# Altium project Oscilloscope.PrjPcb
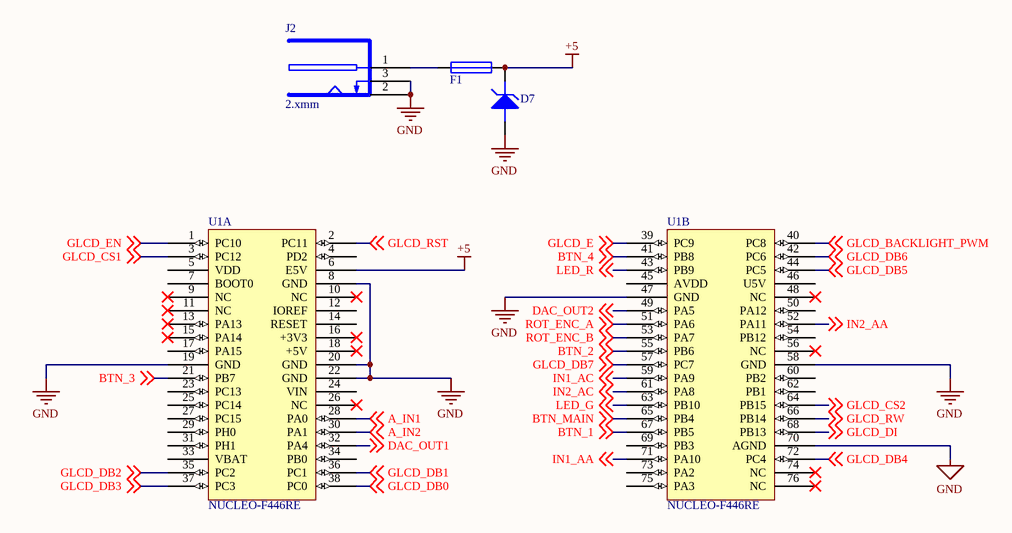
[diagram p0: Nucleo.SchDoc]
5 sheets, 102 parts. Net scope: global (net labels, ports and power ports of the same name join across sheets).
Board file: Oscilloscope.PcbDoc
Sheets:
  Nucleo.SchDoc
  InputStage.SchDoc
  GLCD.SchDoc
  IO.SchDoc
  OutputStage.SchDoc

## Sheet Nucleo.SchDoc: Nucleo
size A4; Organization: BME AUT; Address1: Magyar tudósok krt. 2.; Address2: Q épület; Address3: Budapest; Address4: H-1117; DocumentNumber: 1; Revision: 1.0; SheetNumber: 1; SheetTotal: 2

### Parts
D7  TRANS SUPPR  [FP_SMB]  (value not drawn)
F1  Multifuse  [FP_MULTIFUSE]  (value not drawn)
J2  2.xmm  [FP_DC_TAP_ANYA]
U1  NUCLEO-F446RE  [FP_NUCLEO-64]  (parts A,B of 2)

### Nets
+5: D7.1(CATHODE) F1.2 U1.6(E5V)
GND: D7.2(ANODE) J2.2(SLEEVE) J2.3(BREAK) U1.8(GND) U1.19(GND) U1.20(GND) U1.22(GND) U1.47(GND) U1.58(GND) U1.70(AGND)
A_IN1: U1.28(PA0) ; off-sheet A_IN1
A_IN2: U1.30(PA1) ; off-sheet A_IN2
BTN_1: U1.67(PB5) ; off-sheet BTN_1
BTN_2: U1.55(PB6) ; off-sheet BTN_2
BTN_3: U1.21(PB7) ; off-sheet BTN_3
BTN_4: U1.41(PB8) ; off-sheet BTN_4
BTN_MAIN: U1.65(PB4) ; off-sheet BTN_MAIN
DAC_OUT1: U1.32(PA4) ; off-sheet DAC_OUT1
DAC_OUT2: U1.49(PA5) ; off-sheet DAC_OUT2
GLCD_BACKLIGHT_PWM: U1.40(PC8) ; off-sheet GLCD_BACKLIGHT_PWM
GLCD_CS1: U1.3(PC12) ; off-sheet GLCD_CS1
GLCD_CS2: U1.64(PB15) ; off-sheet GLCD_CS2
GLCD_DB0: U1.38(PC0) ; off-sheet GLCD_DB0
GLCD_DB1: U1.36(PC1) ; off-sheet GLCD_DB1
GLCD_DB2: U1.35(PC2) ; off-sheet GLCD_DB2
GLCD_DB3: U1.37(PC3) ; off-sheet GLCD_DB3
GLCD_DB4: U1.72(PC4) ; off-sheet GLCD_DB4
GLCD_DB5: U1.44(PC5) ; off-sheet GLCD_DB5
GLCD_DB6: U1.42(PC6) ; off-sheet GLCD_DB6
GLCD_DB7: U1.57(PC7) ; off-sheet GLCD_DB7
GLCD_DI: U1.68(PB13) ; off-sheet GLCD_DI
GLCD_E: U1.39(PC9) ; off-sheet GLCD_E
GLCD_EN: U1.1(PC10) ; off-sheet GLCD_EN
GLCD_RST: U1.2(PC11) ; off-sheet GLCD_RST
GLCD_RW: U1.66(PB14) ; off-sheet GLCD_RW
IN1_AA: U1.71(PA10) ; off-sheet IN1_AA
IN1_AC: U1.59(PA9) ; off-sheet IN1_AC
IN2_AA: U1.52(PA11) ; off-sheet IN2_AA
IN2_AC: U1.61(PA8) ; off-sheet IN2_AC
LED_G: U1.63(PB10) ; off-sheet LED_G
LED_R: U1.43(PB9) ; off-sheet LED_R
ROT_ENC_A: U1.51(PA6) ; off-sheet ROT_ENC_A
ROT_ENC_B: U1.53(PA7) ; off-sheet ROT_ENC_B
NetF1_1: F1.1 J2.1(PIN)

Not connected (* = marked no-connect by the designer): U1 4(PD2) 5(VDD) 7(BOOT0) 9(NC)* 10(NC)* 11(NC)* 12(IOREF) 13(PA13)* 14(RESET) 15(PA14)* 16(+3V3)* 17(PA15) 18(+5V)* 23(PC13) 24(VIN) 25(PC14) 26(NC)* 27(PC15) 29(PH0) 31(PH1) 33(VBAT) 34(PB0) 45(AVDD) 46(U5V) 48(NC)* 50(PA12) 54(PB12) 56(NC)* 60(PB2) 62(PB1) 69(PB3) 73(PA2) 74(NC)* 75(PA3) 76(NC)*

### Notes on the sheet
- Title
- Size:
- Date:
- A4
- Number:
- Time:
- Revision:
- Sheet
- of
- File:

### Library data of the parts
D7 = TRANS SUPPR: Transient suppressor; Name: 6.7V Ubr 600W UNIDIR. 5V Urwm SMBJ5.0A (STM) DO-214AA (SMB) ˝BUZ˝; Voltage: 6.7V; Supplier: Lomex; Reference: 96-03-67
F1 = Multifuse: 1812 Multifuse; Name: 1.25A 15V 1812L125/16DR POLYFUSE SMD 1812 (LFS) ˝LF125-16˝; Reference: 44-04-71; Supplier: Lomex
J2 = DC_TAP_ANYA: 2.xmm DC HEBA25 TÁPFESZÜLTSÉG ALJZAT ZÁRT, NYÁKBA 90°; Name: TÁP DC ANYA 5.5/2.1/9.5mm DCS-5521-5; Supplier: Lomex; Reference: 43-07-67
U1 = NUCLEO-F446RE: Reference: NUCLEO; Name: Nucleo F446RE; Supplier: Tanszék

## Sheet InputStage.SchDoc: Input Stage
size A3; Organization: BME AUT; Address1: Magyar tudósok krt. 2.; Address2: Q épület; Address3: Budapest; Address4: H-1117; DocumentNumber: 1; Revision: 1.0; SheetNumber: 1; SheetTotal: 2
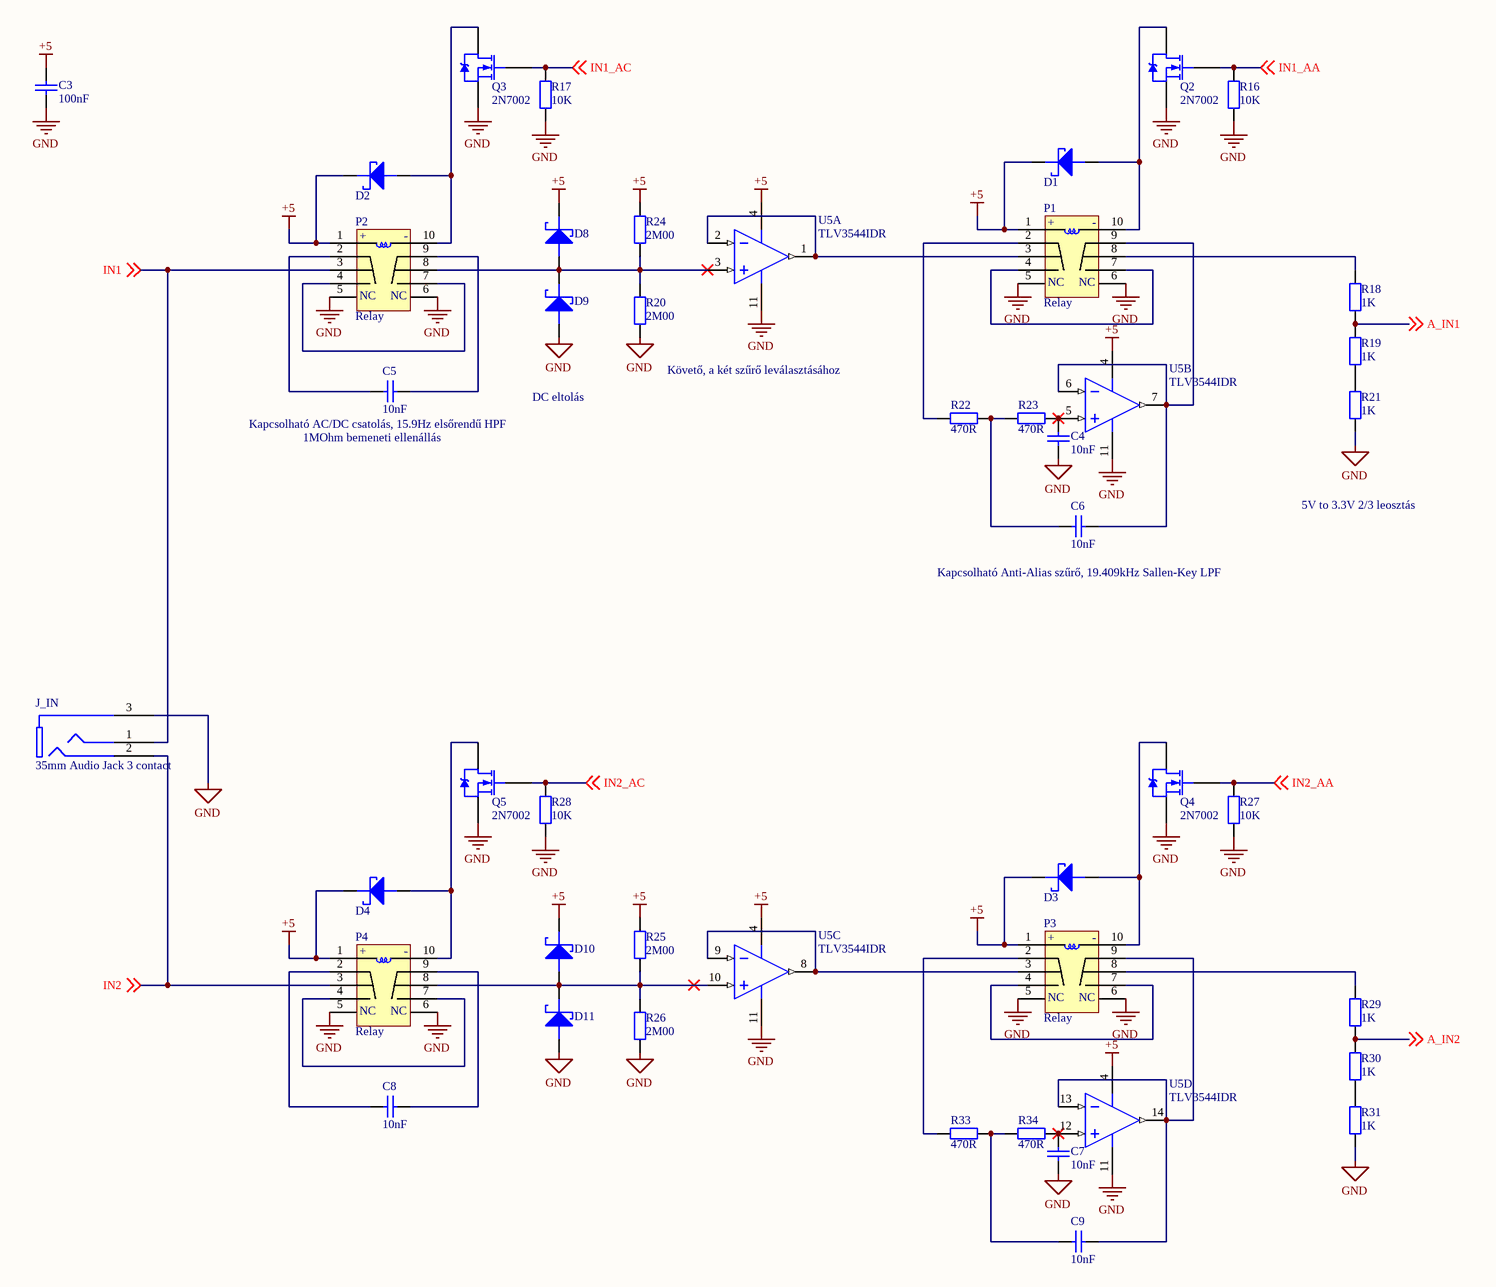
[diagram p1: InputStage.SchDoc]

### Parts
C3  100nF  [FP_0805_CAP_085]
C4  10nF  [FP_0805_CAP_085]
C5  10nF  [FP_0805_CAP_085]
C6  10nF  [FP_0805_CAP_085]
C7  10nF  [FP_0805_CAP_085]
C8  10nF  [FP_0805_CAP_085]
C9  10nF  [FP_0805_CAP_085]
D1  SCHOTTKY SMA  [FP_SMA]  (value not drawn)
D2  SCHOTTKY SMA  [FP_SMA]  (value not drawn)
D3  SCHOTTKY SMA  [FP_SMA]  (value not drawn)
D4  SCHOTTKY SMA  [FP_SMA]  (value not drawn)
D8  SCHOTTKY SMA  [FP_SMA]  (value not drawn)
D9  SCHOTTKY SMA  [FP_SMA]  (value not drawn)
D10  SCHOTTKY SMA  [FP_SMA]  (value not drawn)
D11  SCHOTTKY SMA  [FP_SMA]  (value not drawn)
J_IN  35mm Audio Jack 3 contact  [FP_35MM_JACK_SMALL_3PIN]
P1  Relay  [FP_RELAY]
P2  Relay  [FP_RELAY]
P3  Relay  [FP_RELAY]
P4  Relay  [FP_RELAY]
Q2  2N7002  [FP_SOT23-3]
Q3  2N7002  [FP_SOT23-3]
Q4  2N7002  [FP_SOT23-3]
Q5  2N7002  [FP_SOT23-3]
R16  10K  [FP_0805_RES]
R17  10K  [FP_0805_RES]
R18  1K  [FP_0805_RES]
R19  1K  [FP_0805_RES]
R20  2M00  [FP_0805_RES]
R21  1K  [FP_0805_RES]
R22  470R  [FP_0805_RES]
R23  470R  [FP_0805_RES]
R24  2M00  [FP_0805_RES]
R25  2M00  [FP_0805_RES]
R26  2M00  [FP_0805_RES]
R27  10K  [FP_0805_RES]
R28  10K  [FP_0805_RES]
R29  1K  [FP_0805_RES]
R30  1K  [FP_0805_RES]
R31  1K  [FP_0805_RES]
R33  470R  [FP_0805_RES]
R34  470R  [FP_0805_RES]
U5  TLV3544IDR  [FP_SOIC127P600X175-14M]  (parts A,B,C,D of 4)

### Nets
+5: C3.2 D1.1(CATHODE) D2.1(CATHODE) D3.1(CATHODE) D4.1(CATHODE) D8.1(CATHODE) D10.1(CATHODE) P1.1(+) P2.1(+) P3.1(+) P4.1(+) R24.2 R25.2 U5.4(V+)
GND: C3.1 C4.1 C7.1 D9.2(ANODE) D11.2(ANODE) J_IN.3(GND) P1.5 P1.6 P2.5 P2.6 P3.5 P3.6 P4.5 P4.6 Q2.3(S) Q3.3(S) Q4.3(S) Q5.3(S) R16.2 R17.1 R20.1 R21.1 R26.1 R27.2 R28.2 R31.1 U5.11(GND)
A_IN1: R18.1 R19.2 ; off-sheet A_IN1
A_IN2: R29.1 R30.2 ; off-sheet A_IN2
IN1: J_IN.1(SLEEVE1) P2.3 ; off-sheet IN1
IN1_AA: Q2.1(G) R16.1 ; off-sheet IN1_AA
IN1_AC: Q3.1(G) R17.2 ; off-sheet IN1_AC
IN2: J_IN.2(TIP) P4.3 ; off-sheet IN2
IN2_AA: Q4.1(G) R27.1 ; off-sheet IN2_AA
IN2_AC: Q5.1(G) R28.1 ; off-sheet IN2_AC
NetC4_2: C4.2 R23.2 U5.5(IN2+)
NetC5_1: C5.1 P2.2
NetC5_2: C5.2 P2.9
NetC6_1: C6.1 R22.2 R23.1
NetC6_2: C6.2 P1.9 U5.6(IN2-) U5.7(OUT2)
NetC7_2: C7.2 R34.2 U5.12(IN4+)
NetC8_1: C8.1 P4.2
NetC8_2: C8.2 P4.9
NetC9_1: C9.1 R33.2 R34.1
NetC9_2: C9.2 P3.9 U5.13(IN4-) U5.14(OUT4)
NetD1_2: D1.2(ANODE) P1.10(-) Q2.2(D)
NetD2_2: D2.2(ANODE) P2.10(-) Q3.2(D)
NetD3_2: D3.2(ANODE) P3.10(-) Q4.2(D)
NetD4_2: D4.2(ANODE) P4.10(-) Q5.2(D)
NetD8_2: D8.2(ANODE) D9.1(CATHODE) P2.8 R20.2 R24.1 U5.3(IN1+)
NetD10_2: D10.2(ANODE) D11.1(CATHODE) P4.8 R25.1 R26.2 U5.10(IN3+)
NetP1_2: P1.2 R22.1
NetP1_3: P1.3 U5.1(OUT1) U5.2(IN1-)
NetP1_4: P1.4 P1.7
NetP1_8: P1.8 R18.2
NetP2_4: P2.4 P2.7
NetP3_2: P3.2 R33.1
NetP3_3: P3.3 U5.8(OUT3) U5.9(IN3-)
NetP3_4: P3.4 P3.7
NetP3_8: P3.8 R29.2
NetP4_4: P4.4 P4.7
NetR19_1: R19.1 R21.2
NetR30_1: R30.1 R31.2

### Notes on the sheet
- DC eltolás
- (near R20) Követő, a két szűrő leválasztásához
- (near C5) Kapcsolható AC/DC csatolás, 15.9Hz elsőrendű HPF
- (near C5) 1MOhm bemeneti ellenállás
- 5V to 3.3V 2/3 leosztás
- (near C6) Kapcsolható Anti-Alias szűrő, 19.409kHz Sallen-Key LPF
- Title
- Size:
- Date:
- A3
- Number:
- Time:
- Revision:
- Sheet
- of
- File:
- (in symbol Relay Mini DPDT) NC

### Library data of the parts
C3 = CAP 100nF: Capacitor; Tolerance: 10%; Voltage: 50V; Name: 100nF 0805 10% 50V X7R 0805B104K500CT (WAL); Supplier: Lomex; Reference: 82-10-76; Value: 100nF
C4-C9 = CAP 10nF: Capacitor; Tolerance: 10%; Voltage: 100V; Name: 10nF 0805 10% 100V X7R 08051C103KAT2A (AVX); Supplier: Lomex; Reference: 82-11-02; Value: 10nF
D1-D4 D8-D11 = SCHOTTKY SMA: Schottky diode; pin to pad: 1>2 2>1; Name: 1A 40V DO-214AC SCH.RECT.LOW Vf SSL14 (TSC) SMA; Current: 1A; Voltage: 40V; Supplier: Lomex; Reference: 83-02-20
J_IN = 35mm Audio Jack 3 contact: 3.5mm Audio Jack MX-387GL; Name: MX-387GL -  Phone Audio Connector, 3 Contacts, Jack, 3.5 mm, PCB Mount, Metal Body; Reference: 1267376; Supplier: Farnell
P1-P4 = Relay Mini DPDT: Mini DPDT relay 14x9x5mm; Name: MECH 5V 2xMORSE 1A/30VDC 0.5A/12VAC A5W-K (TAK) 178R 14x9x5mm; Reference: 42-17-08; Supplier: Lomex
Q2-Q5 = 2N7002: N-channel MOSFET; pin to pad: 2>3 3>2; Name: MOSFET Transistor, N Channel, 300mA, 60V, 2.8 ohm, 10V, 2V; Voltage: 60V; Current: 300mA; Supplier: Lomex; Reference: 86-05-52
R16 R17 R27 R28 = RES 10K: Resistor; Tolerance: 5%; Power: 125mW; Name: 10K0 0805 5% CR-05JL7---10K 0.125W (VIK); Supplier: Lomex; Reference: 81-30-45; Value: 10K
R18 R19 R21 R29-R31 = RES 1K: Resistor; Tolerance: 5%; Power: 125mW; Name: 1K00 0805 5% WR08X102JTL 0.125W (WAL); Supplier: Lomex; Reference: 81-27-93; Value: 1K
R20 R24-R26 = RES 2M: Resistor; Tolerance: 1%; Power: 125mW; Name: 2M00 0805 1% CR-05FL7---2M0 0.125W (VIK); Supplier: Lomex; Reference: 80-17-98; Value: 2M00
R22 R23 R33 R34 = RES 470R: Resistor; Tolerance: 5%; Power: 125mW; Name: 470R 0805 5% CR-05JL7--470R 0.125W (VIK); Supplier: Lomex; Reference: 81-10-83; Value: 470R
U5 = TLV3544IDR: Operational Amplifier, RRIO, 4 Amplifier, 200 MHz, 150 V/µs, 2.5V to 5.5V, ± 1.25V to ± 2.75V, SOIC; Reference: 2851094; Name: TLV3544IDR . -  Operational Amplifier; Supplier: Farnell

## Sheet GLCD.SchDoc: GLCD
size A4; Organization: BME AUT; Address1: Magyar tudósok krt. 2.; Address2: Q épület; Address3: Budapest; Address4: H-1117; DocumentNumber: 1; Revision: 1.0; SheetNumber: 1; SheetTotal: 2
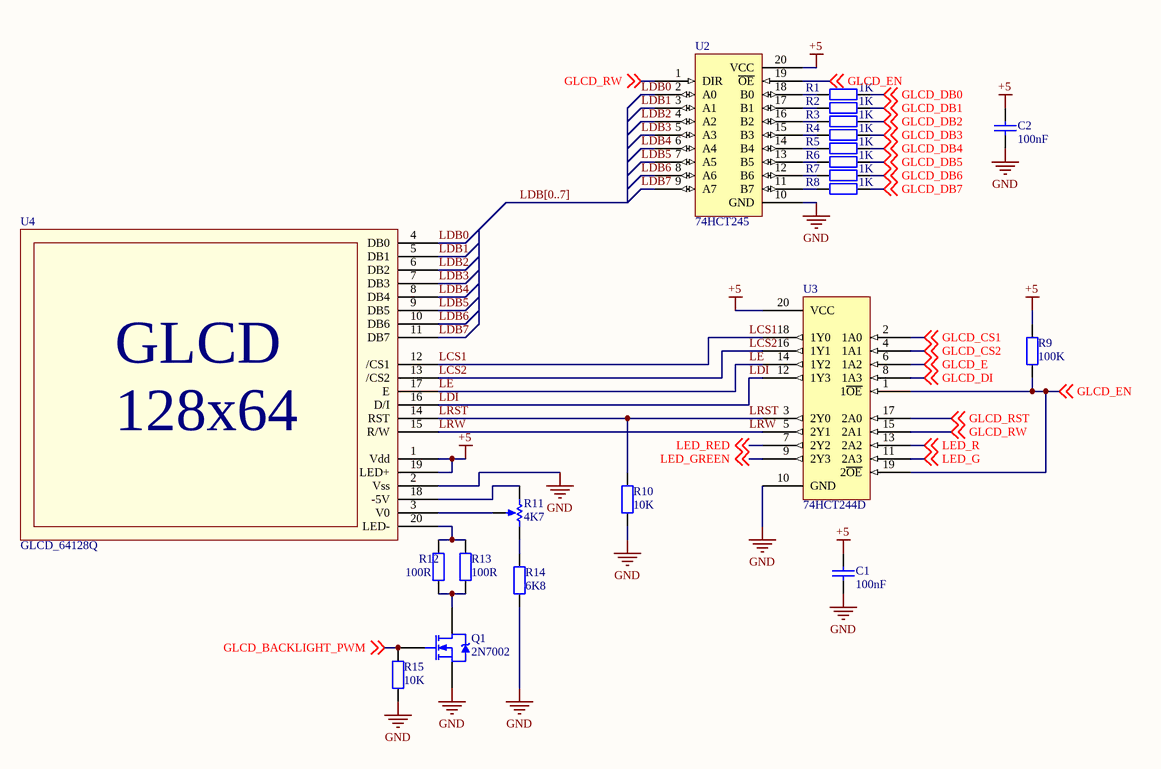
[diagram p2: GLCD.SchDoc]

### Parts
C1  100nF  [FP_0805_CAP_085]
C2  100nF  [FP_0805_CAP_085]
Q1  2N7002  [FP_SOT23-3]
R1  1K  [FP_0805_RES]
R2  1K  [FP_0805_RES]
R3  1K  [FP_0805_RES]
R4  1K  [FP_0805_RES]
R5  1K  [FP_0805_RES]
R6  1K  [FP_0805_RES]
R7  1K  [FP_0805_RES]
R8  1K  [FP_0805_RES]
R9  100K  [FP_0805_RES]
R10  10K  [FP_0805_RES]
R11  4K7  [FP_CERMET_SMD]
R12  100R  [FP_0805_RES]
R13  100R  [FP_0805_RES]
R14  6K8  [FP_0805_RES]
R15  10K  [FP_0805_RES]
U2  74HCT245  [FP_SOP127P1030X265-20M]
U3  74HCT244D  [FP_SOP127P1030X265-20M]
U4  GLCD_64128Q  [FP_GLCD_64128Q]

### Nets
+5: C1.2 C2.2 R9.2 U2.20(VCC) U3.20(VCC) U4.1(Vdd) U4.19(LED+)
GND: C1.1 C2.1 Q1.3(S) R10.1 R14.1 R15.1 U2.10(GND) U3.10(GND) U4.2(Vss)
GLCD_BACKLIGHT_PWM: Q1.1(G) R15.2 ; off-sheet GLCD_BACKLIGHT_PWM
GLCD_CS1: U3.2(1A0) ; off-sheet GLCD_CS1
GLCD_CS2: U3.4(1A1) ; off-sheet GLCD_CS2
GLCD_DB0: R1.2 ; off-sheet GLCD_DB0
GLCD_DB1: R2.2 ; off-sheet GLCD_DB1
GLCD_DB2: R3.2 ; off-sheet GLCD_DB2
GLCD_DB3: R4.2 ; off-sheet GLCD_DB3
GLCD_DB4: R5.2 ; off-sheet GLCD_DB4
GLCD_DB5: R6.2 ; off-sheet GLCD_DB5
GLCD_DB6: R7.2 ; off-sheet GLCD_DB6
GLCD_DB7: R8.2 ; off-sheet GLCD_DB7
GLCD_DI: U3.8(1A3) ; off-sheet GLCD_DI
GLCD_E: U3.6(1A2) ; off-sheet GLCD_E
GLCD_EN: R9.1 U2.19(~{OE}) U3.1(1~{OE}) U3.19(2~{OE}) ; off-sheet GLCD_EN
GLCD_RST: U3.17(2A0) ; off-sheet GLCD_RST
GLCD_RW: U2.1(DIR) U3.15(2A1) ; off-sheet GLCD_RW
LCS1: U3.18(1Y0) U4.12(/CS1)
LCS2: U3.16(1Y1) U4.13(/CS2)
LDB0: U2.2(A0) U4.4(DB0)
LDB1: U2.3(A1) U4.5(DB1)
LDB2: U2.4(A2) U4.6(DB2)
LDB3: U2.5(A3) U4.7(DB3)
LDB4: U2.6(A4) U4.8(DB4)
LDB5: U2.7(A5) U4.9(DB5)
LDB6: U2.8(A6) U4.10(DB6)
LDB7: U2.9(A7) U4.11(DB7)
LDI: U3.12(1Y3) U4.16(D/I)
LE: U3.14(1Y2) U4.17(E)
LED_G: U3.11(2A3) ; off-sheet LED_G
LED_GREEN: U3.9(2Y3) ; off-sheet LED_GREEN
LED_R: U3.13(2A2) ; off-sheet LED_R
LED_RED: U3.7(2Y2) ; off-sheet LED_RED
LRST: R10.2 U3.3(2Y0) U4.14(RST)
LRW: U3.5(2Y1) U4.15(R/W)
NetQ1_2: Q1.2(D) R12.1 R13.1
NetR1_1: R1.1 U2.18(B0)
NetR2_1: R2.1 U2.17(B1)
NetR3_1: R3.1 U2.16(B2)
NetR4_1: R4.1 U2.15(B3)
NetR5_1: R5.1 U2.14(B4)
NetR6_1: R6.1 U2.13(B5)
NetR7_1: R7.1 U2.12(B6)
NetR8_1: R8.1 U2.11(B7)
NetR11_1: R11.1(CCW) U4.18(-5V)
NetR11_2: R11.2(WIPER) U4.3(V0)
NetR11_3: R11.3(CW) R14.2
NetR12_2: R12.2 R13.2 U4.20(LED-)

### Buses and harness runs
bus LDB[0..7]

### Notes on the sheet
- Title
- Size:
- Date:
- A4
- Number:
- Time:
- Revision:
- Sheet
- of
- File:
- (in symbol GLCD_64128Q) GLCD; 128x64

### Library data of the parts
C1 C2 = CAP 100nF: as C3 on sheet InputStage; Supplier: Lomex; Reference: 82-10-76; Value: 100nF
Q1 = 2N7002: N-channel MOSFET; pin to pad: 2>3 3>2; Name: MOSFET Transistor, N Channel, 300mA, 60V, 2.8 ohm, 10V, 2V; Voltage: 60V; Current: 300mA; Supplier: Lomex; Reference: 86-05-52
R1-R8 = RES 1K: as R18 on sheet InputStage; Supplier: Lomex; Reference: 81-27-93; Value: 1K
R9 = RES 100K: Resistor; Tolerance: 5%; Power: 125mW; Name: 100K 0805 5% WR08X104JTL 0.125W (WAL); Supplier: Lomex; Reference: 81-30-68; Value: 100K
R10 R15 = RES 10K: as R16 on sheet InputStage; Supplier: Lomex; Reference: 81-30-45; Value: 10K
R11 = Cermet Pot 4K7: 4K70 3305-472R (KIC) 3x3.8mm CERMET; Reference: 90-00-68; Supplier: Lomex; Name: 4K70 3305-472R (KIC) 3x3.8mm CERMET; Value: 4K7
R12 R13 = RES 100R: Resistor; Tolerance: 5%; Power: 125mW; Name: 100R 0805 5% WR08X101JTL 0.125W (WAL); Supplier: Lomex; Reference: 81-30-00; Value: 100R
R14 = RES 6K8: Resistor; Tolerance: 5%; Power: 125mW; Name: 6K80 0805 5% WR08X682JTL 0.125W (WAL); Supplier: Lomex; Reference: 81-30-41; Value: 6K8
U2 = 74HCT245: 8x Bidirectional bus transciever; Name: 74HCT245D  Transceiver, 74HCT245; Supplier: Lomex; Reference: 87-06-35
U3 = 74HCT244D: 8xBuffer/Line Driver; Name: 74HCT244D-Q100,118  Buffer / Line Driver, 74HCT244; Reference: 87-05-95; Supplier: Lomex
U4 = GLCD_64128Q: 64128QCCBW-3LP; Name: 128x 64 DOT LIGHT:LED 64128QCCBW-3LP (DIS) 0.4/DOT 75x53mm BLUE STN LOW.POW. WIDE TEMP. (CONTROLLER/DRIVER: SBN6400G-D + SBN0064G-D); Supplier: Lomex; Reference: 37-00-71

## Sheet IO.SchDoc: User IO
size A4; Organization: BME AUT; Address1: Magyar tudósok krt. 2.; Address2: Q épület; Address3: Budapest; Address4: H-1117; DocumentNumber: 1; Revision: 1.0; SheetNumber: 1; SheetTotal: 2
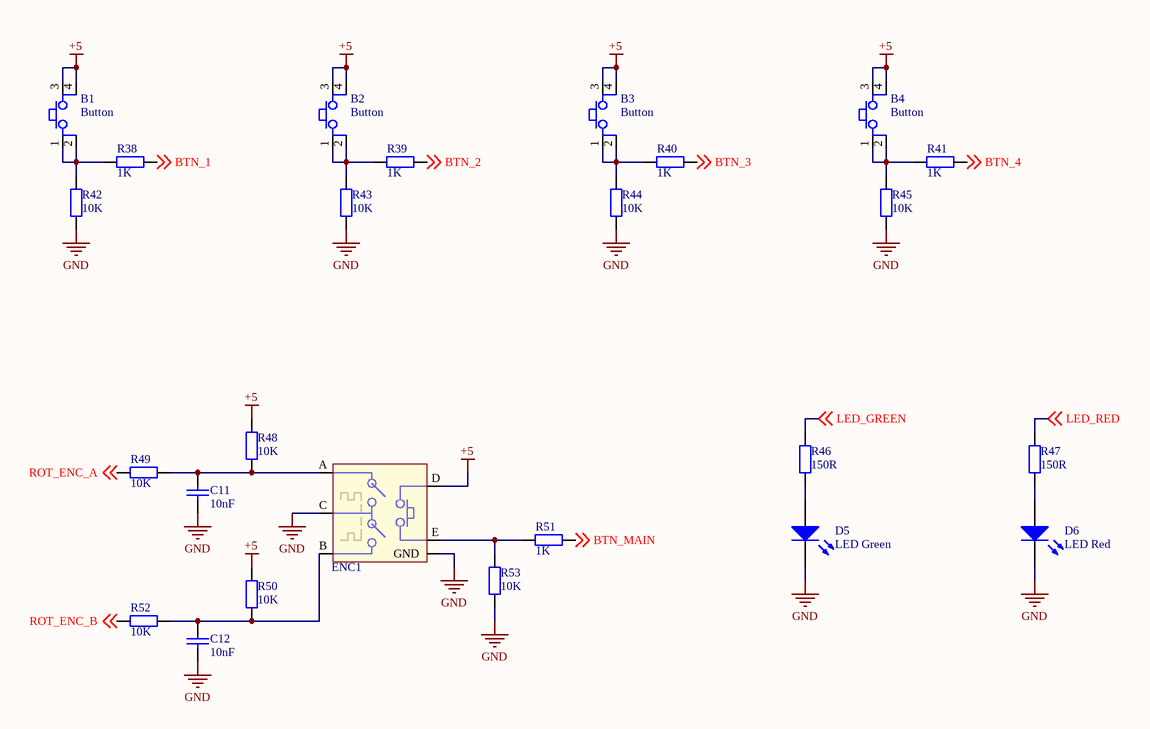
[diagram p3: IO.SchDoc]

### Parts
B1  Button  [FP_BTN_SMD]
B2  Button  [FP_BTN_SMD]
B3  Button  [FP_BTN_SMD]
B4  Button  [FP_BTN_SMD]
C11  10nF  [FP_0805_CAP_085]
C12  10nF  [FP_0805_CAP_085]
D5  LED Green  [FP_0805_LED_RED]
D6  LED Red  [FP_0805_LED_RED]
ENC1  Rotary Encoder  [FP_PEC11S]  (value not drawn)
R38  1K  [FP_0805_RES]
R39  1K  [FP_0805_RES]
R40  1K  [FP_0805_RES]
R41  1K  [FP_0805_RES]
R42  10K  [FP_0805_RES]
R43  10K  [FP_0805_RES]
R44  10K  [FP_0805_RES]
R45  10K  [FP_0805_RES]
R46  150R  [FP_0805_RES]
R47  150R  [FP_0805_RES]
R48  10K  [FP_0805_RES]
R49  10K  [FP_0805_RES]
R50  10K  [FP_0805_RES]
R51  1K  [FP_0805_RES]
R52  10K  [FP_0805_RES]
R53  10K  [FP_0805_RES]

### Nets
+5: B1.3 B1.4 B2.3 B2.4 B3.3 B3.4 B4.3 B4.4 ENC1.D R48.2 R50.2
GND: C11.1 C12.1 D5.K D6.K ENC1.C ENC1.GND R42.1 R43.1 R44.1 R45.1 R53.1
BTN_1: R38.2 ; off-sheet BTN_1
BTN_2: R39.2 ; off-sheet BTN_2
BTN_3: R40.2 ; off-sheet BTN_3
BTN_4: R41.2 ; off-sheet BTN_4
BTN_MAIN: R51.2 ; off-sheet BTN_MAIN
LED_GREEN: R46.2 ; off-sheet LED_GREEN
LED_RED: R47.2 ; off-sheet LED_RED
ROT_ENC_A: R49.1 ; off-sheet ROT_ENC_A
ROT_ENC_B: R52.1 ; off-sheet ROT_ENC_B
NetB1_1: B1.1 B1.2 R38.1 R42.2
NetB2_1: B2.1 B2.2 R39.1 R43.2
NetB3_1: B3.1 B3.2 R40.1 R44.2
NetB4_1: B4.1 B4.2 R41.1 R45.2
NetC11_2: C11.2 ENC1.A R48.1 R49.2
NetC12_2: C12.2 ENC1.B R50.1 R52.2
NetD5_A: D5.A R46.1
NetD6_A: D6.A R47.1
NetENC1_E: ENC1.E R51.1 R53.2

### Notes on the sheet
- Title
- Size:
- Date:
- A4
- Number:
- Time:
- Revision:
- Sheet
- of
- File:

### Library data of the parts
B1-B4 = Button: Push button; Name: TACT 6x 6 4P SPST 1 FSM2JSMA (TYC) 50mA 12VDC SMD H=4.3mm 160g BLACK B. 2-1437565-7; Reference: 45-05-42; Supplier: Lomex
C11 C12 = CAP 10nF: as C4 on sheet InputStage; Supplier: Lomex; Reference: 82-11-02; Value: 10nF
D5 = LED Green: Green LED; U_fw: 2.2V; I_max: 25mA; Name: 2012 GREEN 568nm 15mcd KP-2012SGC (KIN) W.CLEAR 2x1.2x1.1mm 0805 120°; Wavelength: 568nm; Supplier: Lomex; Reference: 95-01-09
D6 = LED Red: Red LED; U_fw: 1.85V; I_max: 30mA; Name: 2012 RED 640nm 100mcd KP-2012SRC-PRV (KIN) W.CLEAR 2x1.2x1.1mm 0805 120°; Wavelength: 640nm; Supplier: Lomex; Reference: 95-01-68
ENC1 = PEC11S-929K: Encoders 9.5 MM SHAFT W/SWITCH 2 DET; Name: PEC11S-929K-H0015
R38-R41 R51 = RES 1K: as R18 on sheet InputStage; Supplier: Lomex; Reference: 81-27-93; Value: 1K
R42-R45 R48-R50 R52 R53 = RES 10K: as R16 on sheet InputStage; Supplier: Lomex; Reference: 81-30-45; Value: 10K
R46 R47 = RES 150R: Resistor; Tolerance: 5%; Power: 125mW; Name: 150R 0805 5% CR-05JL7--150R 0.125W (VIK); Supplier: Lomex; Reference: 81-10-77; Value: 150R

## Sheet OutputStage.SchDoc: Output Stage
size A4; Organization: BME AUT; Address1: Magyar tudósok krt. 2.; Address2: Q épület; Address3: Budapest; Address4: H-1117; DocumentNumber: 1; Revision: 1.0; SheetNumber: 1; SheetTotal: 2
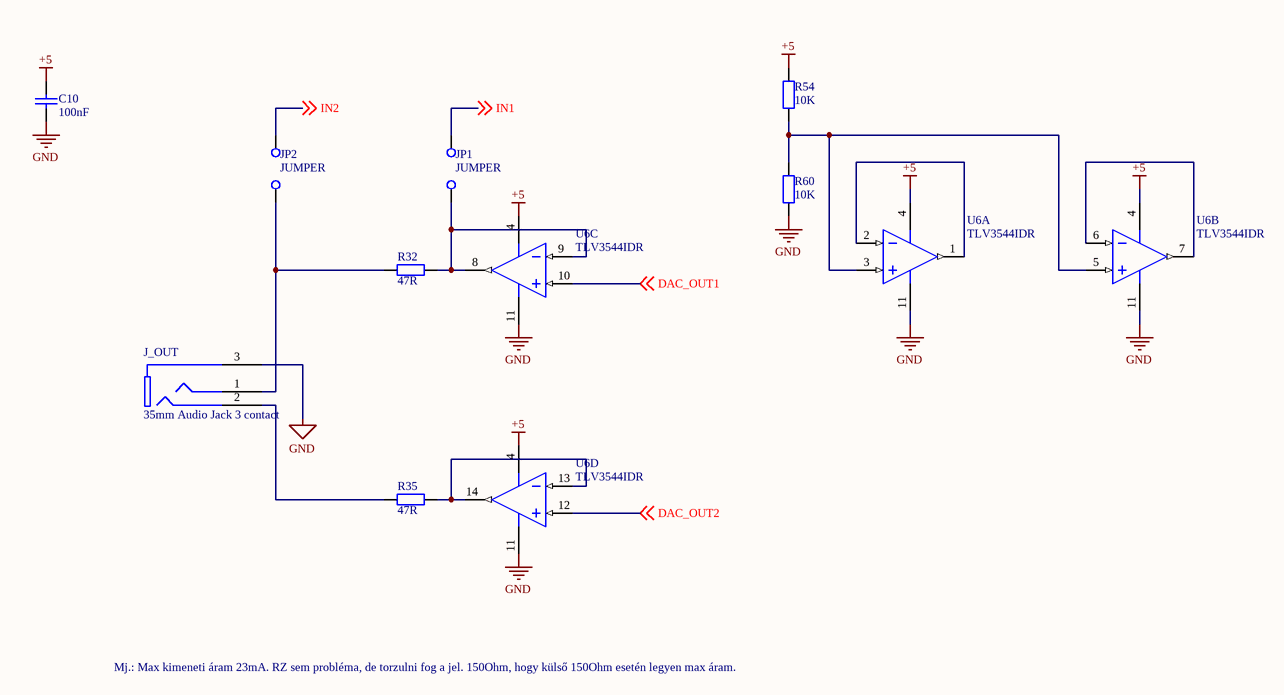
[diagram p4: OutputStage.SchDoc]

### Parts
C10  100nF  [FP_0805_CAP_085]
J_OUT  35mm Audio Jack 3 contact  [FP_35MM_JACK_SMALL_3PIN]
JP1  JUMPER  [FP_CONN2_TUSKE_254MM]
JP2  JUMPER  [FP_CONN2_TUSKE_254MM]
R32  47R  [FP_0805_RES]
R35  47R  [FP_0805_RES]
R54  10K  [FP_0805_RES]
R60  10K  [FP_0805_RES]
U6  TLV3544IDR  [FP_SOIC127P600X175-14M]  (parts A,B,C,D of 4)

### Nets
+5: C10.2 R54.2 U6.4(V+)
GND: C10.1 J_OUT.3(GND) R60.1 U6.11(GND)
DAC_OUT1: U6.10(IN3+) ; off-sheet DAC_OUT1
DAC_OUT2: U6.12(IN4+) ; off-sheet DAC_OUT2
IN1: JP1.2(C2) ; off-sheet IN1
IN2: JP2.1(C1) ; off-sheet IN2
NetJ_OUT_1: J_OUT.1(SLEEVE1) JP2.2(C2) R32.1
NetJ_OUT_2: J_OUT.2(TIP) R35.1
NetJP1_1: JP1.1(C1) R32.2 U6.8(OUT3) U6.9(IN3-)
NetR35_2: R35.2 U6.13(IN4-) U6.14(OUT4)
NetR54_1: R54.1 R60.2 U6.3(IN1+) U6.5(IN2+)
NetU6_1: U6.1(OUT1) U6.2(IN1-)
NetU6_6: U6.6(IN2-) U6.7(OUT2)

### Notes on the sheet
- Mj.: Max kimeneti áram 23mA. RZ sem probléma, de torzulni fog a jel. 150Ohm, hogy külső 150Ohm esetén legyen max áram.
- Title
- Size:
- Date:
- A4
- Number:
- Time:
- Revision:
- Sheet
- of
- File:

### Library data of the parts
C10 = CAP 100nF: as C3 on sheet InputStage; Supplier: Lomex; Reference: 82-10-76; Value: 100nF
J_OUT = 35mm Audio Jack 3 contact: as J_IN on sheet InputStage; Supplier: Farnell
JP1 JP2 = JUMPER: Jumper Wire
R32 R35 = RES 47R: Resistor; Tolerance: 5%; Power: 125mW; Name: 47R0 0805 5% WR08X470JTL 0.125W (WAL); Supplier: Lomex; Reference: 81-28-06; Value: 47R
R54 R60 = RES 10K: as R16 on sheet InputStage; Supplier: Lomex; Reference: 81-30-45; Value: 10K
U6 = TLV3544IDR: as U5 on sheet InputStage; Supplier: Farnell

## Nets that join several sheets
+5: Nucleo (D7.1 F1.2 U1.6), InputStage (14 pins), GLCD (7 pins), IO (11 pins), OutputStage (C10.2 R54.2 U6.4)
GND: Nucleo (10 pins), InputStage (27 pins), GLCD (9 pins), IO (11 pins), OutputStage (C10.1 J_OUT.3 R60.1 U6.11)
A_IN1: Nucleo (U1.28), InputStage (R18.1 R19.2)
A_IN2: Nucleo (U1.30), InputStage (R29.1 R30.2)
BTN_1: Nucleo (U1.67), IO (R38.2)
BTN_2: Nucleo (U1.55), IO (R39.2)
BTN_3: Nucleo (U1.21), IO (R40.2)
BTN_4: Nucleo (U1.41), IO (R41.2)
BTN_MAIN: Nucleo (U1.65), IO (R51.2)
DAC_OUT1: Nucleo (U1.32), OutputStage (U6.10)
DAC_OUT2: Nucleo (U1.49), OutputStage (U6.12)
GLCD_BACKLIGHT_PWM: Nucleo (U1.40), GLCD (Q1.1 R15.2)
GLCD_CS1: Nucleo (U1.3), GLCD (U3.2)
GLCD_CS2: Nucleo (U1.64), GLCD (U3.4)
GLCD_DB0: Nucleo (U1.38), GLCD (R1.2)
GLCD_DB1: Nucleo (U1.36), GLCD (R2.2)
GLCD_DB2: Nucleo (U1.35), GLCD (R3.2)
GLCD_DB3: Nucleo (U1.37), GLCD (R4.2)
GLCD_DB4: Nucleo (U1.72), GLCD (R5.2)
GLCD_DB5: Nucleo (U1.44), GLCD (R6.2)
GLCD_DB6: Nucleo (U1.42), GLCD (R7.2)
GLCD_DB7: Nucleo (U1.57), GLCD (R8.2)
GLCD_DI: Nucleo (U1.68), GLCD (U3.8)
GLCD_E: Nucleo (U1.39), GLCD (U3.6)
GLCD_EN: Nucleo (U1.1), GLCD (R9.1 U2.19 U3.1 U3.19)
GLCD_RST: Nucleo (U1.2), GLCD (U3.17)
GLCD_RW: Nucleo (U1.66), GLCD (U2.1 U3.15)
IN1: InputStage (J_IN.1 P2.3), OutputStage (JP1.2)
IN1_AA: Nucleo (U1.71), InputStage (Q2.1 R16.1)
IN1_AC: Nucleo (U1.59), InputStage (Q3.1 R17.2)
IN2: InputStage (J_IN.2 P4.3), OutputStage (JP2.1)
IN2_AA: Nucleo (U1.52), InputStage (Q4.1 R27.1)
IN2_AC: Nucleo (U1.61), InputStage (Q5.1 R28.1)
LED_G: Nucleo (U1.63), GLCD (U3.11)
LED_GREEN: GLCD (U3.9), IO (R46.2)
LED_R: Nucleo (U1.43), GLCD (U3.13)
LED_RED: GLCD (U3.7), IO (R47.2)
ROT_ENC_A: Nucleo (U1.51), IO (R49.1)
ROT_ENC_B: Nucleo (U1.53), IO (R52.1)